# EAGLE schematic esp8266-temp (EAGLE 7.4.0)
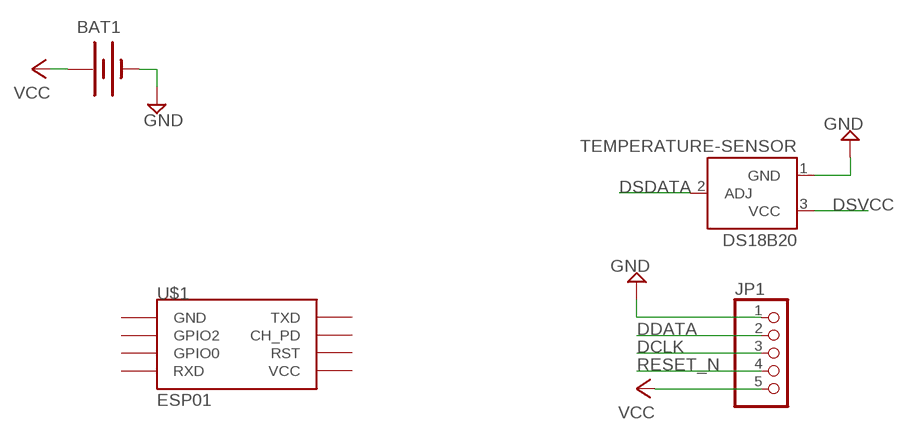
[diagram p0: schematic, sheet 1]

## Parts
BAT1  BATTERY20PTH  [BATTCOM_20MM_PTH]
DS18B20  TEMPERATURE-SENSOR  [TO-92]
JP1  PINHD-1X5  [1X05]
U$1  ESP01  [ESP01]

## Nets
DCLK: JP1.3
DDATA: JP1.2
DSDATA: DS18B20.2(ADJ)
DSVCC: DS18B20.3(VCC)
GND: BAT1.2(-) DS18B20.1(GND) JP1.1
RESET_N: JP1.4
VCC: BAT1.1(+) JP1.5
Unconnected: U$1.CH_PD U$1.GND U$1.GPIO0 U$1.GPIO2 U$1.RST U$1.RX(RXD) U$1.TX(TXD) U$1.VCC

## Library data of the parts
BAT1 = SparkFun-Electromechanical:BATTERY: Battery Holders Various common sizes : AA, AAA, 18650 (PRT-12895), 20mm coin cell and 12mm coin cell. 20MM_4LEGS, BATT-10373
DS18B20 = SparkFun-Sensors:TEMPERATURE-SENSOR: TO-92 temp sensor
JP1 = pinhead:PINHD-1X5: PIN HEADER
U$1 = esp8266modules:ESP01: ESP8266 Wifi module 01